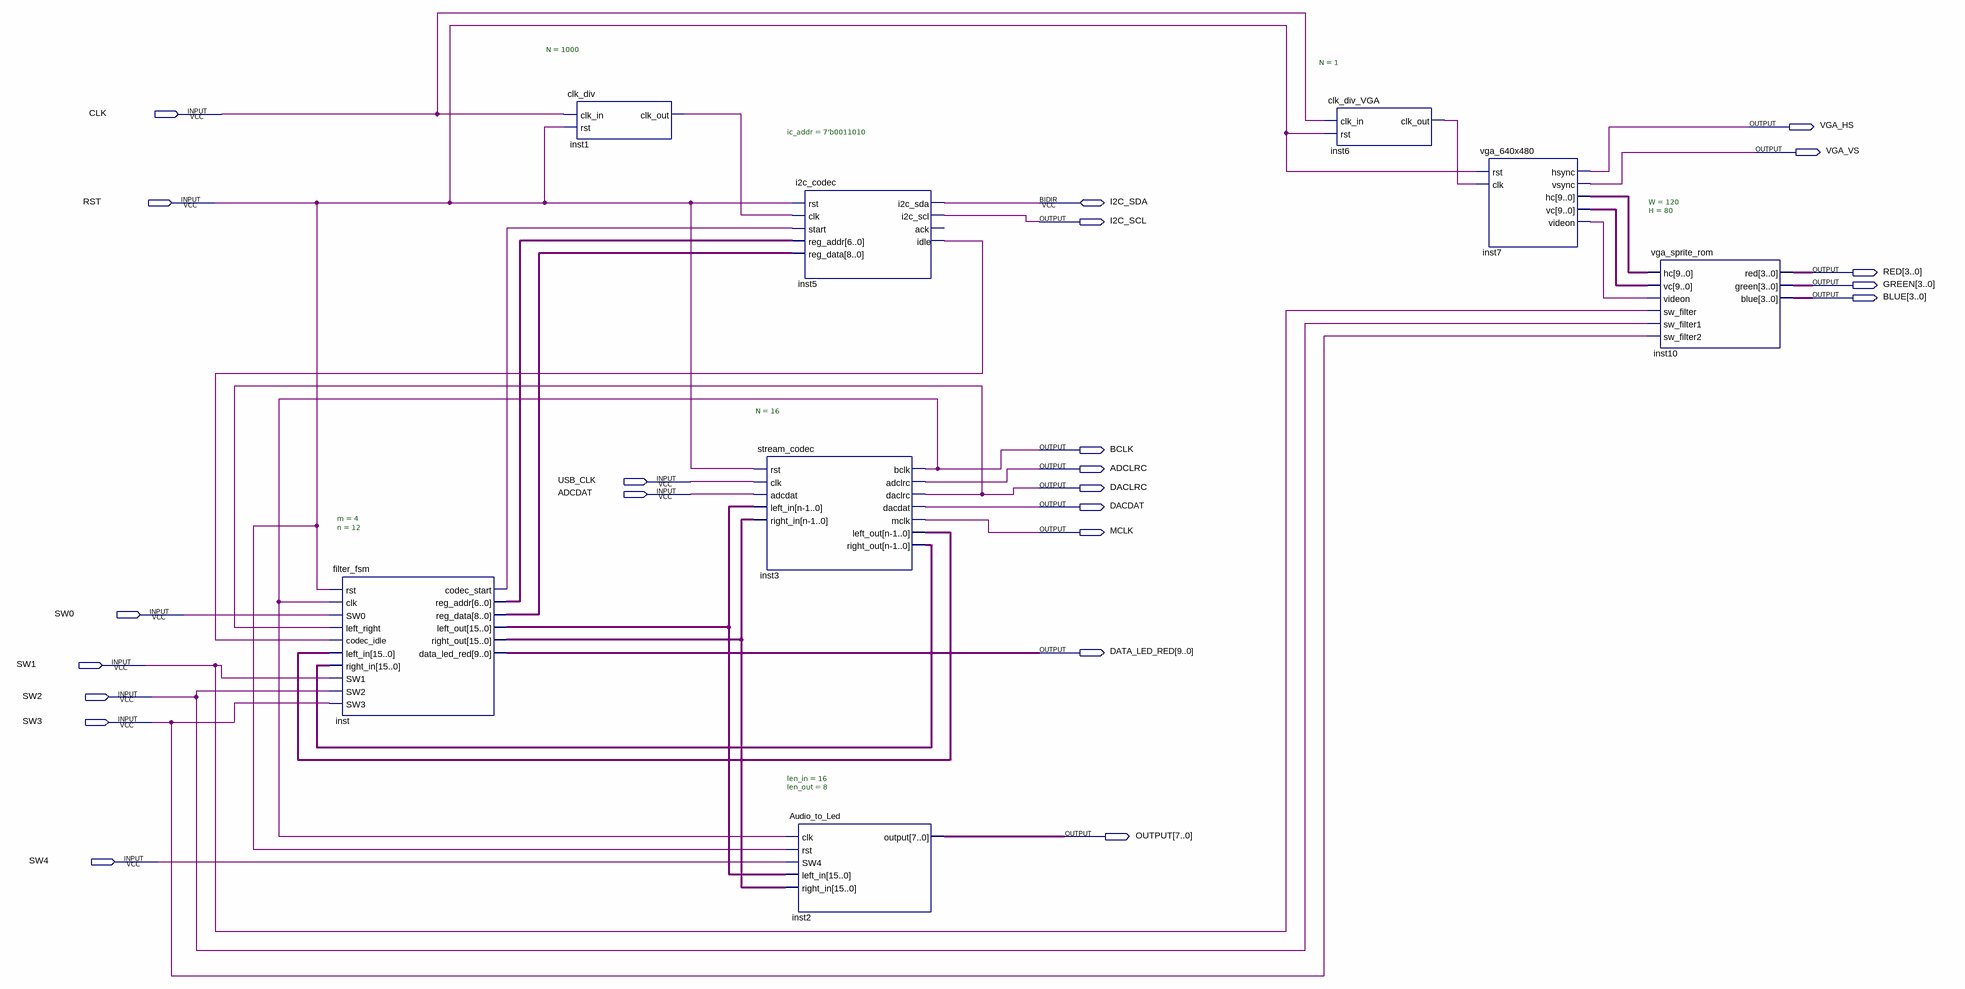
[diagram p0: schematic sheet]
// Quartus schematic top.bdf as structural Verilog: 8 symbols, 23 pins
module top (
  input  CLK,
  input  RST,
  input  USB_CLK,
  input  ADCDAT,
  input  SW0,
  input  SW1,
  input  SW2,
  input  SW3,
  input  SW4,
  inout  I2C_SDA,
  output VGA_HS,
  output VGA_VS,
  output I2C_SCL,
  output [3:0] RED,
  output [3:0] GREEN,
  output [3:0] BLUE,
  output BCLK,
  output ADCLRC,
  output DACLRC,
  output DACDAT,
  output MCLK,
  output [9:0] DATA_LED_RED,
  output [7:0] OUTPUT
);

  wire inst1_clk_out, inst5_idle, inst6_clk_out, inst7_videon, inst_codec_start;
  wire [6:0] inst_reg_addr;
  wire [8:0] inst_reg_data;
  wire [9:0] inst7_hc, inst7_vc;
  wire [15:0] inst3_left_out, inst3_right_out, inst_left_out, inst_right_out;

  filter_fsm #(.m(4), .n(12)) inst (
    .rst(RST), .clk(BCLK), .SW0(SW0), .left_right(DACLRC), .codec_idle(inst5_idle), .left_in(inst3_left_out),
    .right_in(inst3_right_out), .SW1(SW1), .SW2(SW2), .SW3(SW3), .codec_start(inst_codec_start),
    .reg_addr(inst_reg_addr), .reg_data(inst_reg_data), .left_out(inst_left_out), .right_out(inst_right_out),
    .data_led_red(DATA_LED_RED));
  clk_div #(.N(1000)) inst1 (.clk_in(CLK), .rst(RST), .clk_out(inst1_clk_out));
  stream_codec #(.N(16)) inst3 (
    .rst(RST), .clk(USB_CLK), .adcdat(ADCDAT), .left_in(inst_left_out), .right_in(inst_right_out),
    .bclk(BCLK), .adclrc(ADCLRC), .daclrc(DACLRC), .dacdat(DACDAT), .mclk(MCLK), .left_out(inst3_left_out),
    .right_out(inst3_right_out));
  Audio_to_Led #(.len_in(16), .len_out(8)) inst2 (
    .clk(BCLK), .rst(RST), .SW4(SW4), .left_in(inst_left_out), .right_in(inst_right_out), .\output (OUTPUT));
  i2c_codec #(.ic_addr(7'b0011010)) inst5 (
    .rst(RST), .clk(inst1_clk_out), .start(inst_codec_start), .reg_addr(inst_reg_addr),
    .reg_data(inst_reg_data), .i2c_scl(I2C_SCL), .idle(inst5_idle), .i2c_sda(I2C_SDA));  // open: ack
  clk_div_VGA #(.N(1)) inst6 (.clk_in(CLK), .rst(RST), .clk_out(inst6_clk_out));
  vga_640x480 inst7 (
    .rst(RST), .clk(inst6_clk_out), .hsync(VGA_HS), .vsync(VGA_VS), .hc(inst7_hc), .vc(inst7_vc),
    .videon(inst7_videon));
  vga_sprite_rom #(.W(120), .H(80)) inst10 (
    .hc(inst7_hc), .vc(inst7_vc), .videon(inst7_videon), .sw_filter(SW1), .sw_filter1(SW2), .sw_filter2(SW3),
    .red(RED), .green(GREEN), .blue(BLUE));
endmodule
